# EAGLE schematic esquema_eletrico_eagle (EAGLE 9.7.0)
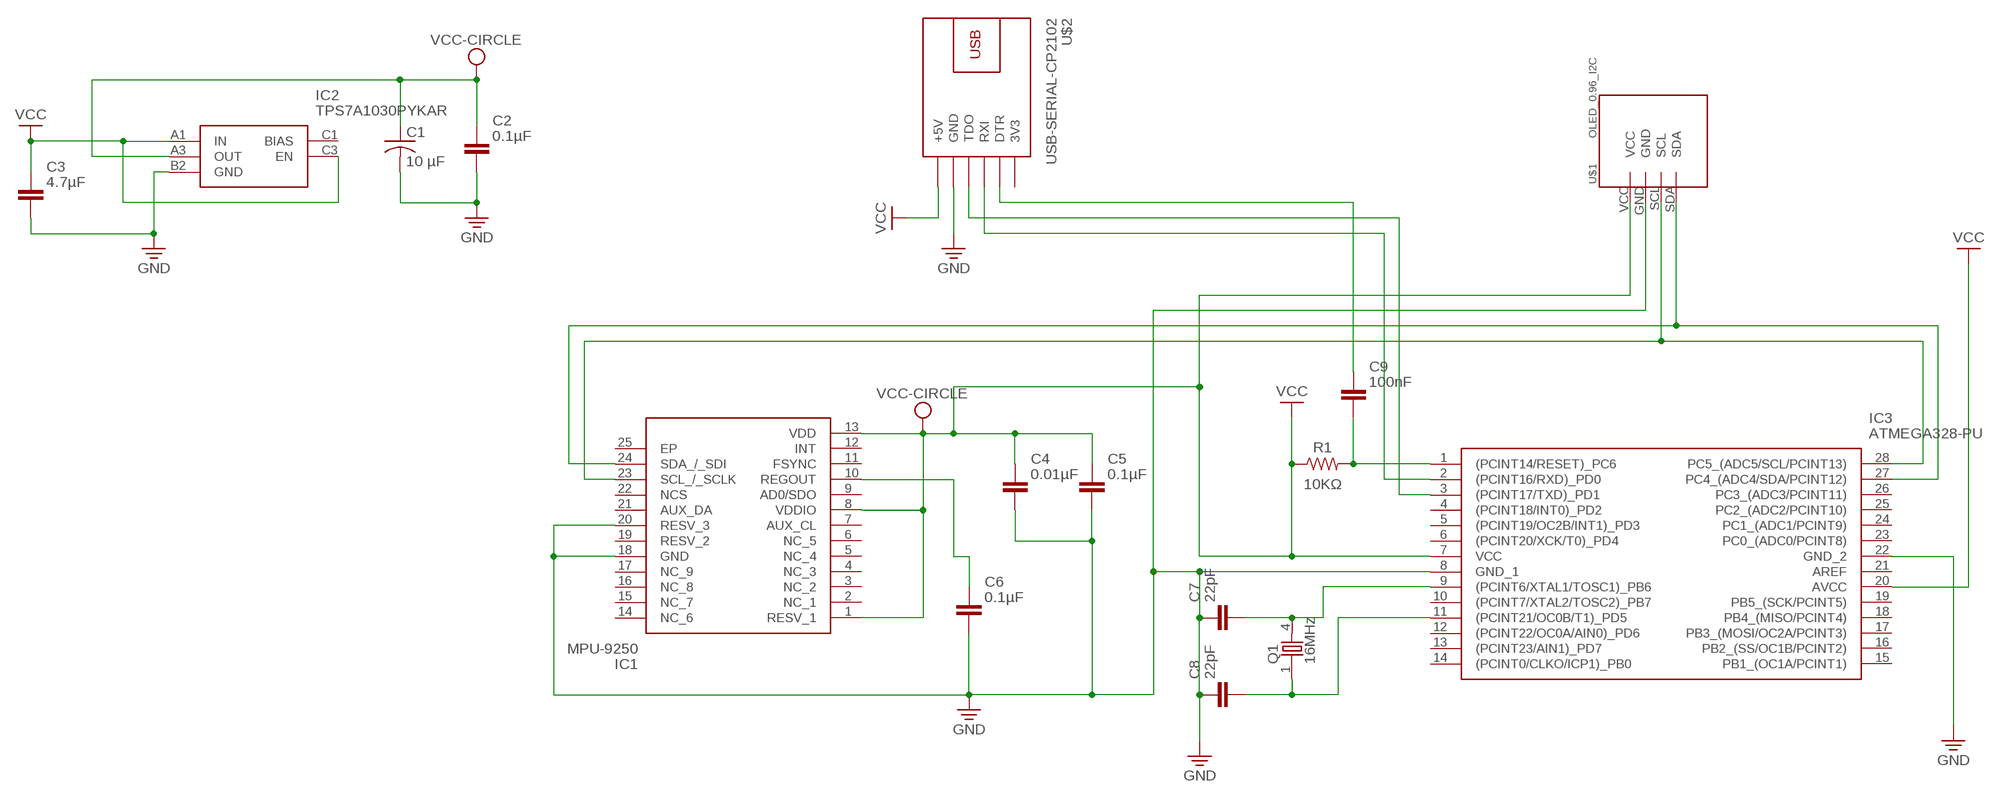
[diagram p0: schematic, sheet 1]

## Parts
C1  10 µF  C-US_CHIP-0402(1005-METRIC)  [CAPC1005X60]
C2  0.1µF  C_CHIP-0402(1005-METRIC)  [CAPC1005X60]
C3  4.7µF  C_CHIP-0402(1005-METRIC)  [CAPC1005X60]
C4  0.01µF  C_CHIP-0402(1005-METRIC)  [CAPC1005X60]
C5  0.1µF  C_CHIP-0402(1005-METRIC)  [CAPC1005X60]
C6  0.1µF  C_CHIP-0402(1005-METRIC)  [CAPC1005X60]
C7  22pF  C_CHIP-0402(1005-METRIC)  [CAPC1005X60]
C8  22pF  C_CHIP-0402(1005-METRIC)  [CAPC1005X60]
C9  100nF  C_CHIP-0402(1005-METRIC)  [CAPC1005X60]
IC1  MPU-9250  [QFN40P300X300X105-25N]
IC2  TPS7A1030PYKAR  [TPS7A1030PYKAR]
IC3  ATMEGA328-PU  [DIP1016W53P254L3468H457Q28N]
Q1  16MHz  86SMX  [86SMX]
R1  10KΩ  R-US_CHIP-0603(1608-METRIC)  [RESC1608X60]
U$1  OLED_0.96_I2C  [OLED_0.96_I2C]
U$2  USB-SERIAL-CP2102  [USB-SERIAL-CP2102]

## Nets
GND: C1.2 C2.2 C3.2 C4.2 C5.2 C6.2 C7.1 C8.1 IC1.18(GND) IC1.20(RESV_3) IC2.B2(GND) IC3.8(GND_1) IC3.22(GND_2) U$1.GND U$2.5(GND)
N$1: IC3.2((PCINT16/RXD)_PD0) U$2.3(RXI)
N$2: IC1.24(SDA_/_SDI) IC3.27(PC4_(ADC4/SDA/PCINT12)) U$1.SDA
N$3: IC1.23(SCL_/_SCLK) IC3.28(PC5_(ADC5/SCL/PCINT13)) U$1.SCL
N$4: IC3.3((PCINT17/TXD)_PD1) U$2.4(TDO)
N$5: C9.1 U$2.2(DTR)
N$9: C6.1 IC1.10(REGOUT)
N$10: C9.2 IC3.1((PCINT14/RESET)_PC6) R1.2
N$11: C7.2 IC3.9((PCINT6/XTAL1/TOSC1)_PB6) Q1.4
N$12: C8.2 IC3.11((PCINT21/OC0B/T1)_PD5) Q1.1
VCC: C1.1 C2.1 C3.1 C4.1 C5.1 IC1.1(RESV_1) IC1.8(VDDIO) IC1.13(VDD) IC2.A1(IN) IC2.A3(OUT) IC2.C3(EN) IC3.7(VCC) IC3.20(AVCC) R1.1 U$1.VCC U$2.6(+5V) ; supply symbol labelled VCC-CIRCLE
Unconnected: IC1.2(NC_1) IC1.3(NC_2) IC1.4(NC_3) IC1.5(NC_4) IC1.6(NC_5) IC1.7(AUX_CL) IC1.9(AD0/SDO) IC1.11(FSYNC) IC1.12(INT) IC1.14(NC_6) IC1.15(NC_7) IC1.16(NC_8) IC1.17(NC_9) IC1.19(RESV_2) IC1.21(AUX_DA) IC1.22(NCS) IC1.25(EP) IC2.C1(BIAS) IC3.4((PCINT18/INT0)_PD2) IC3.5((PCINT19/OC2B/INT1)_PD3) IC3.6((PCINT20/XCK/T0)_PD4) IC3.10((PCINT7/XTAL2/TOSC2)_PB7) IC3.12((PCINT22/OC0A/AIN0)_PD6) IC3.13((PCINT23/AIN1)_PD7) IC3.14((PCINT0/CLKO/ICP1)_PB0) IC3.15(PB1_(OC1A/PCINT1)) IC3.16(PB2_(SS/OC1B/PCINT2)) IC3.17(PB3_(MOSI/OC2A/PCINT3)) IC3.18(PB4_(MISO/PCINT4)) IC3.19(PB5_(SCK/PCINT5)) IC3.21(AREF) IC3.23(PC0_(ADC0/PCINT8)) IC3.24(PC1_(ADC1/PCINT9)) IC3.25(PC2_(ADC2/PCINT10)) IC3.26(PC3_(ADC3/PCINT11))

## Power pins joined to a net without a drawn wire
3V3: U$2.1(3V3)

## Library data of the parts
C1 = Capacitor:C-US: Capacitor - ANSI; CATEGORY: Capacitor
C2-C9 = Capacitor:C: Capacitor - Generic; CATEGORY: Capacitor
IC1 = MPU-9250:MPU-9250: Accelerometer, Gyroscope, Magnetometer, 3 Axis Sensor IC, SPI Output Source: Datasheet <http://www.invensense.com/wp-content/uploads/2015/02/PS-MPU-9250A-01-v1.1.pdf>; ARROW_PART_NUMBER: MPU-9250; ARROW_PRICE-STOCK: https://www.arrow.com/en/products/mpu-9250/tdk; DESCRIPTION: Accelerometer, Gyroscope, Magnetometer, 3 Axis Sensor IC, SPI Output; HEIGHT: 1.05mm; MANUFACTURER_NAME: TDK; MANUFACTURER_PART_NUMBER: MPU-9250; MOUSER_PART_NUMBER: 410-MPU-9250; MOUSER_PRICE-STOCK: https://www.mouser.co.uk/ProductDetail/TDK-InvenSense/MPU-9250?qs=u4fy%2FsgLU9OhGjFkQSZssA%3D%3D
IC2 = LDO 3.3v:TPS7A1030PYKAR: 300-mA low-IQ ultra-low-dropout (LDO) (70 mV at 300 mA) linear regulator Source: Datasheet <http://www.ti.com/lit/gpn/tps7a10>; ARROW_PART_NUMBER: TPS7A1030PYKAR; ARROW_PRICE-STOCK: https://www.arrow.com/en/products/tps7a1030pykar/texas-instruments?region=nac; DESCRIPTION: 300-mA low-IQ ultra-low-dropout (LDO) (70 mV at 300 mA) linear regulator; HEIGHT: mm; MANUFACTURER_NAME: Texas Instruments; MANUFACTURER_PART_NUMBER: TPS7A1030PYKAR; MOUSER_PART_NUMBER: 595-TPS7A1030PYKAR; MOUSER_PRICE-STOCK: https://www.mouser.co.uk/ProductDetail/Texas-Instruments/TPS7A1030PYKAR?qs=gTYE2QTfZfS%252BOiFUcXGdIg%3D%3D
IC3 = ATMEGA328-PU:ATMEGA328-PU: 8-bit Microcontrollers - MCU AVR 32K FLSH 1K EE2K SRAM-20MHz IND Source: Datasheet <https://componentsearchengine.com/Datasheets/1/ATMEGA328-PU.pdf>; ARROW_PART_NUMBER: ATMEGA328-PU; ARROW_PRICE-STOCK: https://www.arrow.com/en/products/atmega328-pu/microchip-technology?region=nac; DESCRIPTION: 8-bit Microcontrollers - MCU AVR 32K FLSH 1K EE2K SRAM-20MHz IND; HEIGHT: 4.572mm; MANUFACTURER_NAME: Microchip; MANUFACTURER_PART_NUMBER: ATMEGA328-PU; MOUSER_PART_NUMBER: 556-ATMEGA328-PU; MOUSER_PRICE-STOCK: https://www.mouser.co.uk/ProductDetail/Microchip-Technology-Atmel/ATMEGA328-PU?qs=lwdSMh1%2FoYJT8tfItQpQtA%3D%3D
Q1 = crystal:86SMX: CRYSTAL
R1 = Resistor:R-US: Resistor Fixed - ANSI; CATEGORY: Resistor; SUB-CATEGORY: Fixed
U$1 = oled_autodesk:OLED_0.96_I2C
U$2 = USB TO TTL:USB-SERIAL-CP2102: USB to Serial UART Converter based on CP2102 chip More information about CP2102 chip is available here: https://www.silabs.com/documents/public/data-sheets/CP2102-9.pdf Drivers for CP210x devices are available here: http://www.silabs.com/products/development-tools/software/usb-to-uart-bridge-vcp-drivers Click here to find device on ebay.com <http://www.ebay.com/sch/cp2102+micro+usb>